# Altium project CNC SHIELD.PrjPcb
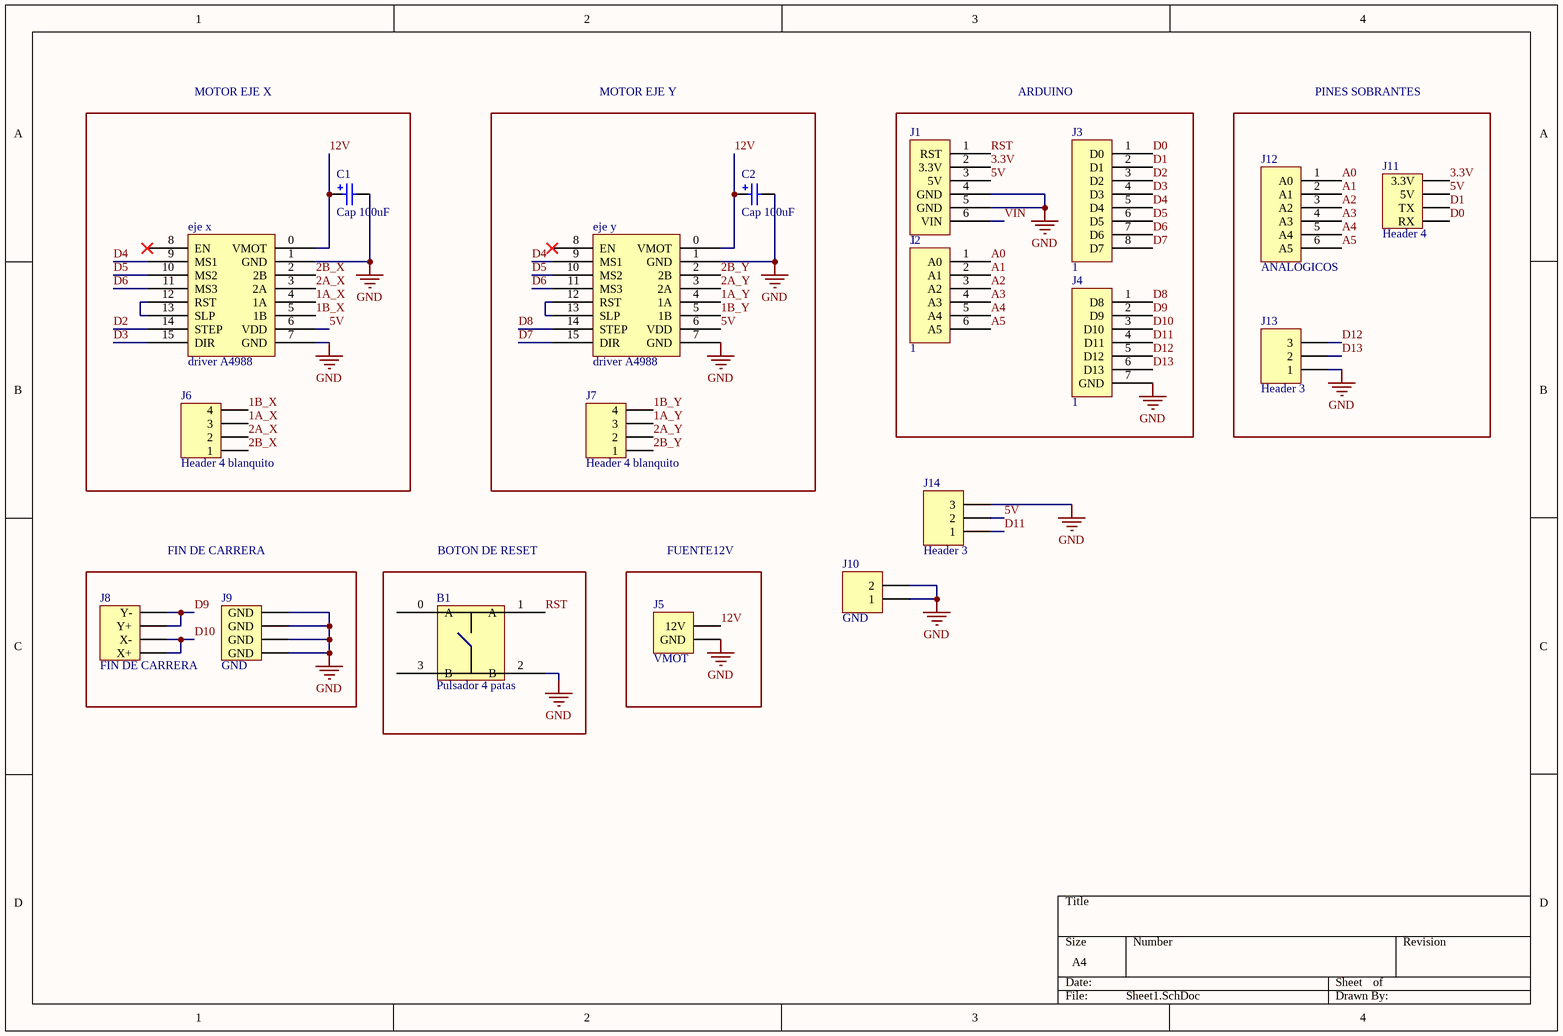
[diagram p0: Sheet1.SchDoc]
1 sheet, 19 parts. Net scope: global (net labels, ports and power ports of the same name join across sheets).
Board file: PCB1.PcbDoc

## Sheet Sheet1.SchDoc
size A4

### Parts
B1  Pulsador 4 patas  [Pulsador4patas]
C1  Cap 100uF  [Cap 100uF 50V]
C2  Cap 100uF  [Cap 100uF 50V]
eje_x  driver A4988  [DRIVER A4988]
eje_y  driver A4988  [DRIVER A4988]
J1  1  [HDR1X6]
J2  1  [HDR1X6]
J3  1  [HDR1X8]
J4  1  [HDR1X7]
J5  VMOT  [Bornerax2]
J6  Header 4 blanquito  [HDR1X4 blanquito]
J7  Header 4 blanquito  [HDR1X4 blanquito]
J8  FIN DE CARRERA  [HDR1X4]
J9  GND  [HDR1X4]
J10  GND  [HDR1X2]
J11  Header 4  [HDR1X4]
J12  ANALOGICOS  [HDR1X6]
J13  Header 3  [HDR1X3]
J14  Header 3  [HDR1X3]

### Blocks framed on the sheet
MOTOR EJE X: C1 eje_x J6
MOTOR EJE Y: C2 eje_y J7
ARDUINO: J1-J4
PINES SOBRANTES: J11-J13
FIN DE CARRERA: J8 J9
BOTON DE RESET: B1
FUENTE12V: J5

### Nets
GND: B1.2(B) C1.2 C2.2 eje_x.1(GND) eje_x.7(GND) eje_y.1(GND) eje_y.7(GND) J1.4(GND) J1.5(GND) J4.7(GND) J5.1(GND) J9.1(GND) J9.2(GND) J9.3(GND) J9.4(GND) J10.1 J10.2 J13.1 J14.3
1A_X: eje_x.4(1A) J6.3
1A_Y: eje_y.4(1A) J7.3
1B_X: eje_x.5(1B) J6.4
1B_Y: eje_y.5(1B) J7.4
2A_X: eje_x.3(2A) J6.2
2A_Y: eje_y.3(2A) J7.2
2B_X: eje_x.2(2B) J6.1
2B_Y: eje_y.2(2B) J7.1
3.3V: J1.2(3.3V) J11.4(3.3V)
5V: eje_x.6(VDD) eje_y.6(VDD) J1.3(5V) J11.3(5V) J14.2
12V: C1.1 C2.1 eje_x.0(VMOT) eje_y.0(VMOT) J5.2(12V)
A0: J2.1(A0) J12.1(A0)
A1: J2.2(A1) J12.2(A1)
A2: J2.3(A2) J12.3(A2)
A3: J2.4(A3) J12.4(A3)
A4: J2.5(A4) J12.5(A4)
A5: J2.6(A5) J12.6(A5)
D0: J3.1(D0) J11.1(RX)
D1: J3.2(D1) J11.2(TX)
D2: eje_x.14(STEP) J3.3(D2)
D3: eje_x.15(DIR) J3.4(D3)
D4: eje_x.9(MS1) eje_y.9(MS1) J3.5(D4)
D5: eje_x.10(MS2) eje_y.10(MS2) J3.6(D5)
D6: eje_x.11(MS3) eje_y.11(MS3) J3.7(D6)
D7: eje_y.15(DIR) J3.8(D7)
D8: eje_y.14(STEP) J4.1(D8)
D9: J4.2(D9) J8.3(Y+) J8.4(Y-)
D10: J4.3(D10) J8.1(X+) J8.2(X-)
D11: J4.4(D11) J14.1
D12: J4.5(D12) J13.3
D13: J4.6(D13) J13.2
RST: B1.1(A) J1.1(RST)
VIN: J1.6(VIN)
Neteje_x_12: eje_x.12(RST) eje_x.13(SLP)
Neteje_y_12: eje_y.12(RST) eje_y.13(SLP)

Not connected (* = marked no-connect by the designer): B1 0(A) 3(B); eje_x 8(EN)*; eje_y 8(EN)*

### Library data of the parts
C1 C2 = Cap 100uF 50V: Polarized Capacitor (Radial); Published: 8-Jun-2000; LatestRevisionDate: 17-Jul-2002; LatestRevisionNote: Re-released for DXP Platform.; PackageReference: RB7.6-15; Publisher: Altium Limited; PackageDescription: Polarized Capacitor (Radial); 2 Leads
J1 J2 J12 = header X6
J3 = header X8
J4 = header X7
J5 = Bornerax2: Header, 2-Pin; LatestRevisionDate: 17-Jul-2002; LatestRevisionNote: Re-released for DXP Platform.; Publisher: Altium Limited
J6 J7 = Header 4_1: Header, 2-Pin; LatestRevisionDate: 17-Jul-2002; LatestRevisionNote: Re-released for DXP Platform.; Publisher: Altium Limited
J8 J9 J11 = Header 4: Header, 2-Pin; LatestRevisionDate: 17-Jul-2002; LatestRevisionNote: Re-released for DXP Platform.; Publisher: Altium Limited
J10 = Header 2: Header, 2-Pin; LatestRevisionDate: 17-Jul-2002; LatestRevisionNote: Re-released for DXP Platform.; Publisher: Altium Limited
J13 J14 = Header 3: Header, 3-Pin; LatestRevisionDate: 17-Jul-2002; LatestRevisionNote: Re-released for DXP Platform.; Publisher: Altium Limited